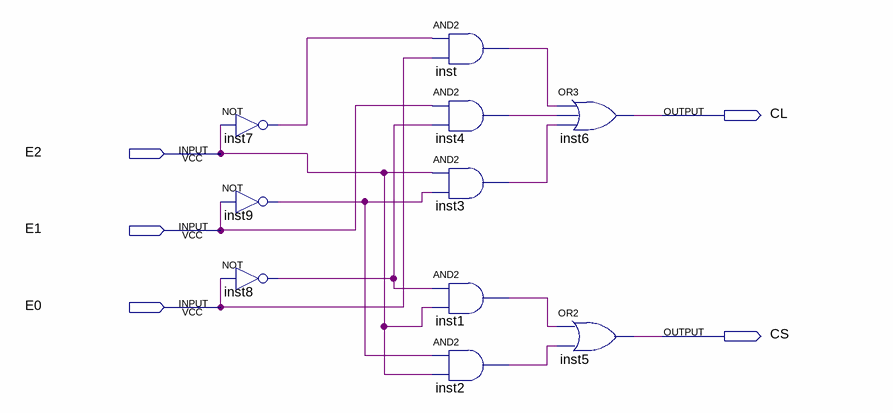
[diagram p0: schematic sheet]
// Quartus schematic DecodControle.bdf as structural Verilog: 10 symbols, 5 pins
module DecodControle (
  input  E2,
  input  E1,
  input  E0,
  output CL,
  output CS
);

  wire inst1_out, inst2_out, inst3_out, inst4_out, inst7_out, inst8_out, inst9_out, inst_out;

  not inst7 (inst7_out, E2);
  not inst9 (inst9_out, E1);
  not inst8 (inst8_out, E0);
  and inst (inst_out, inst7_out, E0);
  and inst4 (inst4_out, E1, inst8_out);
  and inst3 (inst3_out, E2, inst9_out);
  and inst1 (inst1_out, inst8_out, E2);
  and inst2 (inst2_out, inst9_out, E2);
  or inst6 (CL, inst_out, inst4_out, inst3_out);
  or inst5 (CS, inst1_out, inst2_out);
endmodule
